# Altium schematic sheet ICM42605.SchDoc
size A4
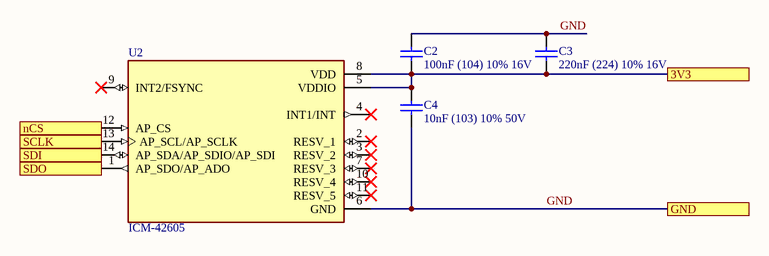
[diagram p0: ICM42605.SchDoc]

## Parts
C2  100nF (104) 10% 16V  [0402_C]
C3  220nF (224) 10% 16V  [0402_C]
C4  10nF (103) 10% 50V  [0402_C]
U2  ICM-42605  [PQFN50P300X250X97-14N]

## Ports
3V3, GND, nCS, SCLK, SDI, SDO

## Nets
3V3: C2.1 C3.1 C4.2 U2.5(VDDIO) U2.8(VDD) ; port 3V3
GND: C2.2 C3.2 C4.1 U2.6(GND) ; port GND
nCS: U2.12(AP_CS) ; port nCS
SCLK: U2.13(AP_SCL/AP_SCLK) ; port SCLK
SDI: U2.14(AP_SDA/AP_SDIO/AP_SDI) ; port SDI
SDO: U2.1(AP_SDO/AP_ADO) ; port SDO

Not connected (* = marked no-connect by the designer): U2 2(RESV_1)* 3(RESV_2)* 4(INT1/INT)* 7(RESV_3)* 9(INT2/FSYNC)* 10(RESV_4)* 11(RESV_5)*

## Library data of the parts
C2 = 0402 100nF (104) 10% 16V: 贴片电容; ComponentLink1Description: 供应商链接; ComponentLink1URL: http://www.szlcsc.com/product/details_1877.html; Package: 0402; Supplier: LC; SuppliersPartNumber: C1525
C3 = 0402 220nF (224) 10% 16V: 贴片电容; ComponentLink1Description: 供应商链接; ComponentLink1URL: http://www.szlcsc.com/product/details_17456.html; Package: 0402; Supplier: LC; SuppliersPartNumber: C16772
C4 = 0402 10nF (103) 10% 50V: 贴片电容; ComponentLink1Description: 供应商链接; ComponentLink1URL: http://www.szlcsc.com/product/details_15869.html; Package: 0402; Supplier: LC; SuppliersPartNumber: C15195
U2 = ICM-42605: Accelerometer, Gyroscope, 6 Axis Sensor IÂ²C, I3Câ„ , SPI Output; MF: TDK InvenSense; Value: *; MP: ICM-42605; Package: - TDK InvenSense; SnapEDA_Link: https://www.snapeda.com/parts/ICM-42605/TDK%20InvenSense/view-part/3226540/?ref=snap; Digi-Key_Part_Number: 1428-1152-1-ND; Digi-Key_Purchase_URL: https://www.digikey.com.cn/product-detail/zh/tdk-invensense/ICM-42605/1428-1152-1-ND/9953675?utm_source=snapeda&utm_medium=aggregator&utm_campaign=symbol